# EAGLE design AJH_as3310_DUAL_ASR_02_4hp (EAGLE 9.5.2)
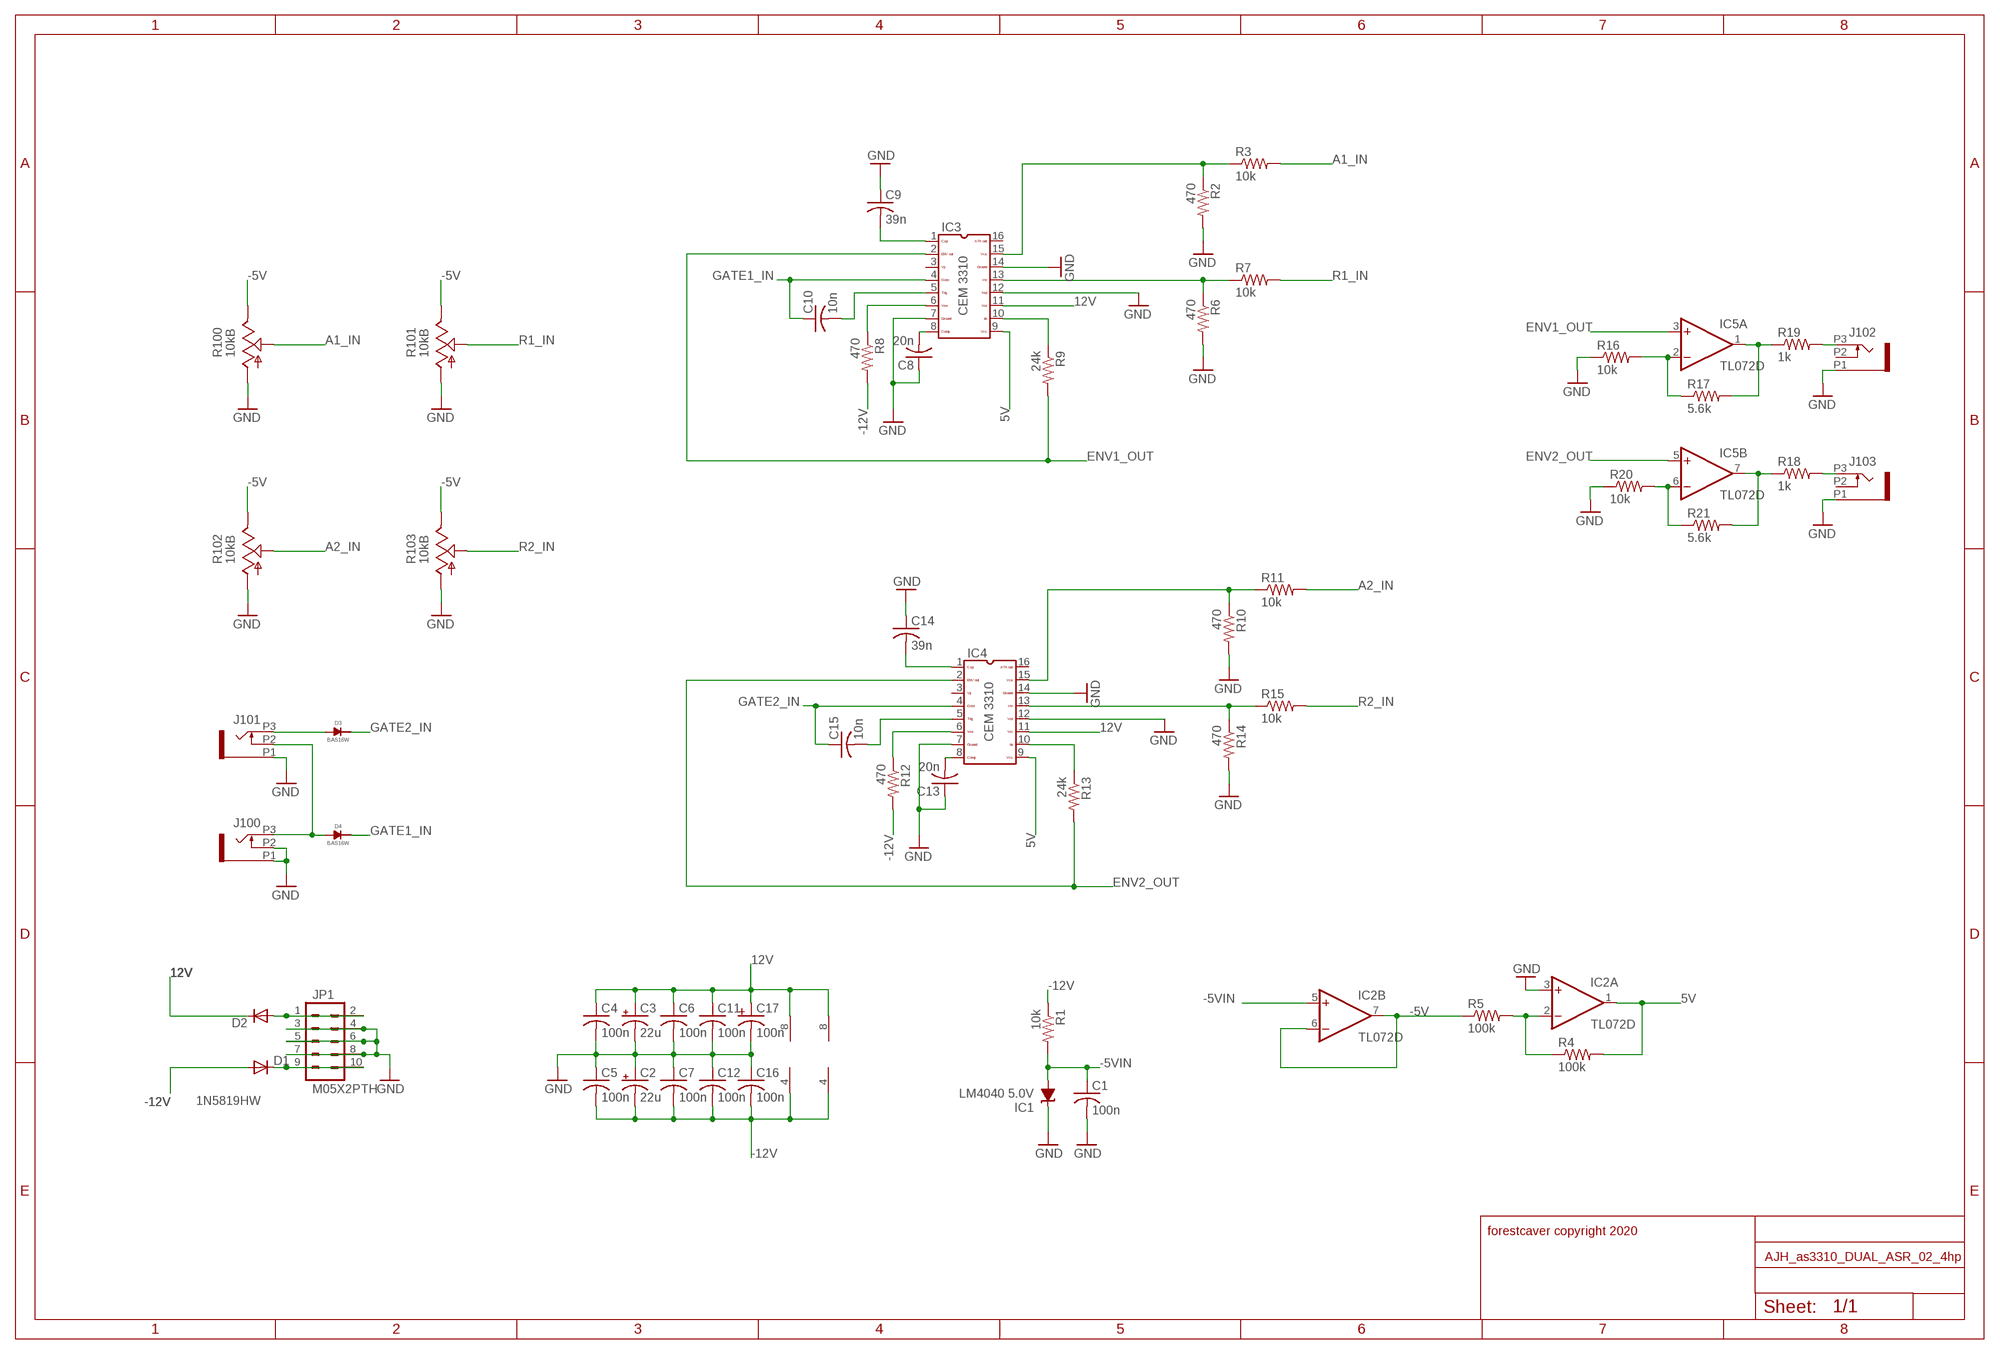
[diagram p0: schematic, sheet 1]

## Parts
C1  100n  C-USC0603  [C0603]
C2  22u  CPOL-USB  [PANASONIC_B]
C3  22u  CPOL-USB  [PANASONIC_B]
C4  100n  C-USC0603  [C0603]
C5  100n  C-USC0603  [C0603]
C6  100n  C-USC0603  [C0603]
C7  100n  C-USC0603  [C0603]
C8  20n  C-USC0603  [C0603]
C9  39n  C-USC0603  [C0603]
C10  10n  C-USC0603  [C0603]
C11  100n  C-USC0603  [C0603]
C12  100n  C-USC0603  [C0603]
C13  20n  C-USC0603  [C0603]
C14  39n  C-USC0603  [C0603]
C15  10n  C-USC0603  [C0603]
C16  100n  C-USC0603  [C0603]
C17  100n  C-USC0603  [C0603]
D1  1N5819HW  DIODE-SOD123  [SOD123]
D2  1N5819HW  DIODE-SOD123  [SOD123]
D3  BAS16W  [SOT-323]
D4  BAS16W  [SOT-323]
IC1  LM4040 5.0V  LM4041C12DBZ  [DBZ_R-PDSO-G3]
IC2  TL072D  [SO08]
IC3  CEM3310SOIC16  [SO16]
IC4  CEM3310SOIC16  [SO16]
IC5  TL072D  [SO08]
J100  PJ301_THONKICONN6  [WQP_PJ_301M6]
J101  PJ301_THONKICONN6  [WQP_PJ_301M6]
J102  PJ301_THONKICONN6  [WQP_PJ_301M6]
J103  PJ301_THONKICONN6  [WQP_PJ_301M6]
JP1  M05X2PTH  [AVR_ICSP]
R1  10k  R-US_R0603  [R0603]
R2  470  R-US_R0603  [R0603]
R3  10k  R-US_R0603  [R0603]
R4  100k  R-US_R0603  [R0603]
R5  100k  R-US_R0603  [R0603]
R6  470  R-US_R0603  [R0603]
R7  10k  R-US_R0603  [R0603]
R8  470  R-US_R0603  [R0603]
R9  24k  R-US_R0603  [R0603]
R10  470  R-US_R0603  [R0603]
R11  10k  R-US_R0603  [R0603]
R12  470  R-US_R0603  [R0603]
R13  24k  R-US_R0603  [R0603]
R14  470  R-US_R0603  [R0603]
R15  10k  R-US_R0603  [R0603]
R16  10k  R-US_R0603  [R0603]
R17  5.6k  R-US_R0603  [R0603]
R18  1k  R-US_R0603  [R0603]
R19  1k  R-US_R0603  [R0603]
R20  10k  R-US_R0603  [R0603]
R21  5.6k  R-US_R0603  [R0603]
R100  10kB  POT_USVERTICAL  [ALPS_POT_VERTICAL]
R101  10kB  POT_USVERTICAL  [ALPS_POT_VERTICAL]
R102  10kB  POT_USVERTICAL  [ALPS_POT_VERTICAL]
R103  10kB  POT_USVERTICAL  [ALPS_POT_VERTICAL]

## Nets
5V [power]: IC2.1(A:OUT) IC3.9 IC4.9 R4.2
12V [power]: C3.+ C4.1 C6.1 C11.1 C17.1 D2.C IC2.8(P:V+) IC3.11 IC4.11 IC5.8(P:V+)
-5V [power]: IC2.6(B:-IN) IC2.7(B:OUT) R5.1 R100.P$1(E) R101.P$1(E) R102.P$1(E) R103.P$1(E)
-5VIN [power]: C1.1 IC1.2(A) IC2.5(B:+IN) R1.2
-12V [power]: C2.- C5.2 C7.2 C12.2 C16.2 D1.A IC2.4(P:V-) IC5.4(P:V-) R1.1 R8.2 R12.2
A1_IN: R3.2 R100.P$2(S)
A2_IN: R11.2 R102.P$2(S)
ENV1_OUT: IC3.2 IC5.3(A:+IN) R9.2
ENV2_OUT: IC4.2 IC5.5(B:+IN) R13.2
GATE1_IN: C10.1 D4.CATHODE IC3.4
GATE2_IN: C15.1 D3.CATHODE IC4.4
GND [power]: C1.2 C2.+ C3.- C4.2 C5.1 C6.2 C7.1 C8.1 C9.1 C11.2 C12.1 C13.1 C14.1 C16.1 C17.2 IC1.1(C) IC2.3(A:+IN) IC3.7 IC3.12 IC3.14 IC4.7 IC4.12 IC4.14 J100.P1 J100.P2 J101.P1 J102.P1 J103.P1 JP1.3 JP1.4 JP1.5 JP1.6 JP1.7 JP1.8 R2.2 R6.2 R10.2 R14.2 R16.1 R20.1 R100.P$3(A) R101.P$3(A) R102.P$3(A) R103.P$3(A)
N$1: D3.ANODE J101.P3
N$2: C15.2 IC4.5
N$3: C9.2 IC3.1
N$4: C8.2 IC3.8
N$5: C10.2 IC3.5
N$6: D2.A JP1.1 JP1.2
N$7: IC3.13 R6.1 R7.1
N$8: IC3.6 R8.1
N$9: C13.2 IC4.8
N$10: IC3.10 R9.1
N$11: IC4.6 R12.1
N$12: IC3.15 R2.1 R3.1
N$13: IC2.2(A:-IN) R4.1 R5.2
N$14: C14.2 IC4.1
N$15: IC4.10 R13.1
N$16: IC4.13 R14.1 R15.1
N$17: IC4.15 R10.1 R11.1
N$18: IC5.6(B:-IN) R20.2 R21.1
N$19: IC5.7(B:OUT) R18.1 R21.2
N$20: D1.C JP1.9 JP1.10
N$21: IC5.2(A:-IN) R16.2 R17.1
N$23: IC5.1(A:OUT) R17.2 R19.1
N$24: J102.P3 R19.2
N$25: J103.P3 R18.2
N$26: D4.ANODE J100.P3 J101.P2
R1_IN: R7.2 R101.P$2(S)
R2_IN: R15.2 R103.P$2(S)
Unconnected: IC3.3 IC3.16 IC4.3 IC4.16 J102.P2 J103.P2

## Notes on the sheet
- +
- forestcaver copyright 2020

## Library data of the parts
C1 C4-C17 = rcl:C-US: CAPACITOR, American symbol
C2 C3 = rcl:CPOL-US: POLARIZED CAPACITOR, American symbol
D1 D2 = diode:DIODE-: DIODE
D3 D4 = FenixBase:BAS16W
IC1 = texas:LM4041: PRECISION MICROPOWER SHUNT VOLTAGE REFERENCE Source: http://focus.ti.com/lit/ds/slcs146e/slcs146e.pdf
IC2 IC5 = linear:TL072: OP AMP
IC3 IC4 = CEM:CEM3310: CEM 3310 VCEG
J100-J103 = og-pj301_variations:PJ301_THONKICONN
JP1 = og-header:M05X2: Header 5x2 Standard 10-pin dual row 0.1" header. Commonly used with AVR-ISP. Use with Spark Fun Electronics SKU: PRT-00778
R1-R21 = resistor:R-US_: RESISTOR, American symbol
R100-R103 = og-pots:POT_US

## Net classes
0 default: width 0.152 mm
1 power: width 0.406 mm
2 nearfilter: width 0.152 mm

## Board
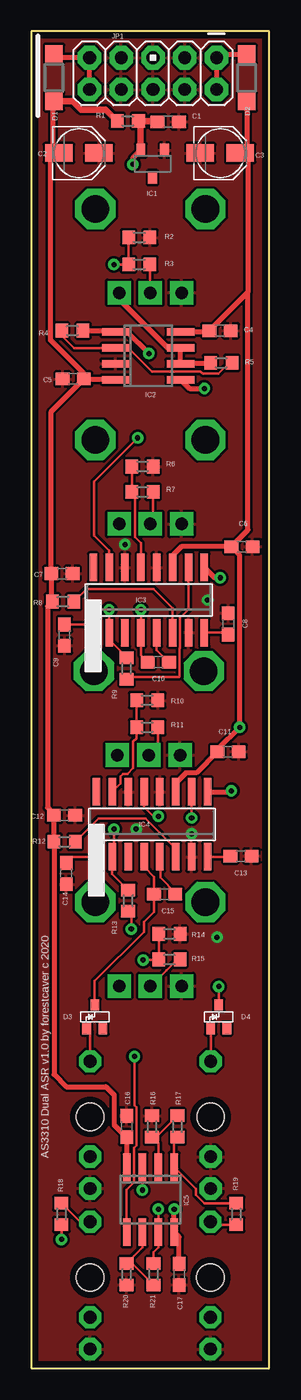
[diagram p1: board, top side]
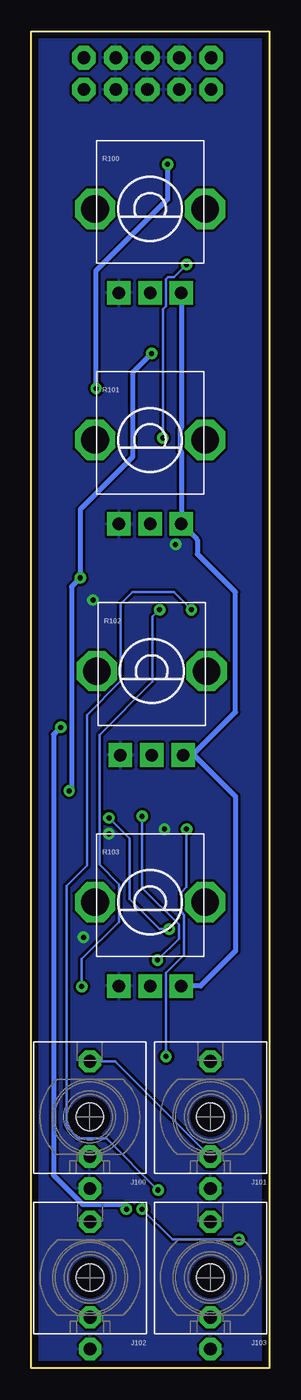
[diagram p2: board, bottom side, seen from below]

Size 19.03 x 106.76 mm. Coordinates in mm from the lower left corner, seen from the top.
Outline: 0,0 19.03,0 19.03,106.76 0,106.76 0,0
Copper layers (1*16): Top 0.035mm / dielectric 1.5mm / Bottom 0.035mm
Design rules "Mutable_PCBCart-Standard": minimum track width 8mil, minimum drill 0.4mm, track to track 8mil, track to pad 8mil, pad to pad 8mil, via to via 8mil, smd to smd 8mil, copper to edge 20mil, drill to drill 8mil, minimum pad ring 8mil, minimum via ring 10mil, stop-mask expansion 3mil, vias tented up to drill 25mil, thermal gap 8mil

### Footprints (pad centres in the part's own frame; a part is rotated, then mirrored left to right if it is on the bottom)
C0603 = smd 1.1 x 1: 1 -0.85,0; 2 0.85,0
PANASONIC_B = smd 2.2 x 1.4: + 1.6,0; - -1.6,0
SOD123 = smd 1.4 x 1.4: A 1.9,0; C -1.9,0
SOT-323 = smd 0.7 x 0.9: ANODE -0.65,-0.95; CATHODE 0,0.95; NC 0.65,-0.95
DBZ_R-PDSO-G3 = smd 0.7 x 1: 1 -0.95,-1.1; 2 0.95,-1.1; 3 0,1.1
SO08 = smd 0.6 x 2.2: 1 -1.905,-2.6; 2 -0.635,-2.6; 3 0.635,-2.6; 4 1.905,-2.6; 5 1.905,2.6; 6 0.635,2.6; 7 -0.635,2.6; 8 -1.905,2.6
SO16 = smd 0.6 x 2.2: 1 -4.445,-2.6; 2 -3.175,-2.6; 3 -1.905,-2.6; 4 -0.635,-2.6; 5 0.635,-2.6; 6 1.905,-2.6; 7 3.175,-2.6; 8 4.445,-2.6; 9 4.445,2.6; 10 3.175,2.6; 11 1.905,2.6; 12 0.635,2.6; 13 -0.635,2.6; 14 -1.905,2.6; 15 -3.175,2.6; 16 -4.445,2.6
WQP_PJ_301M6 = drill 1.016 pad 1.778 octagon: P1 0,-5.715; P2 0,-3.175; P3 0,4.445 | hole 2.2: 0,0
AVR_ICSP = drill 1.016 pad 1.88 octagon: 1 -1.27,5.08; 2 1.27,5.08; 3 -1.27,2.54; 4 1.27,2.54; 5 -1.27,0; 6 1.27,0; 7 -1.27,-2.54; 8 1.27,-2.54; 9 -1.27,-5.08; 10 1.27,-5.08
R0603 = smd 1 x 1.1: 1 -0.85,0; 2 0.85,0
ALPS_POT_VERTICAL = drill 1 pad 1.88 square: P$1 -2.5,6.7; P$2 0,6.7; P$3 2.5,6.7 | drill 2.2 pad 3.175 octagon: P$4 -4.4,0; P$5 4.4,0

### Placement (x,y rotation side)
C1  10.95,99.53 0 top
C2  3.81,97.03 0 top
C3  15.11,97.03 0 top
C4  15.09,82.86 0 top
C5  3.35,78.99 0 top
C6  16.84,65.6 0 top
C7  2.46,63.46 180 top
C8  15.75,59.44 270 top
C9  2.67,58.55 90 top
C10  10.16,56.39 0 top
C11  15.73,49.23 0 top
C12  2.65,44.15 180 top
C13  16.76,40.89 180 top
C14  2.79,39.5 90 top
C15  10.67,37.85 0 top
C16  7.62,19.3 270 top
C17  11.81,7.49 270 top
D1  1.83,103.06 270 top
D2  17.23,103.04 90 top
D3  5.08,28.07 0 top
D4  14.99,28.07 0 top
IC1  9.7,96.17 180 top
IC2  9.35,80.84 270 top
IC3  9.4,61.34 0 top
IC4  9.65,43.43 0 top
IC5  9.53,13.46 180 top
J100  14.35,20.07 0 bottom
J101  4.7,20.07 0 bottom
J102  14.33,7.24 0 bottom
J103  4.7,7.24 0 bottom
JP1  9.74,103.38 270 top
R1  7.73,99.59 0 top
R2  8.64,90.3 0 top
R3  8.64,88.14 0 top
R4  3.28,82.86 0 top
R5  15.19,80.28 0 top
R6  8.89,72.01 0 top
R7  8.89,69.98 0 top
R8  2.54,61.21 180 top
R9  7.62,55.88 90 top
R10  9.27,53.34 0 top
R11  9.27,51.18 0 top
R12  2.67,42.04 180 top
R13  7.75,37.34 90 top
R14  11.05,34.67 0 top
R15  11.05,32.64 0 top
R16  9.65,19.3 270 top
R17  11.68,19.3 270 top
R18  2.41,12.32 90 top
R19  16.38,12.32 270 top
R20  7.62,7.49 90 top
R21  9.78,7.49 90 top
R100  9.53,92.58 180 bottom
R101  9.53,74.13 180 bottom
R102  9.4,55.67 180 bottom
R103  9.53,37.21 180 bottom

### Tracks (layer width: path | path; a pad name or v marks a point on that pad's centre or on a via)
5V  (via drill 0.4)
  Top 0.406: R4.2 6.64,82.86 IC2.1 7.68,82.75 v9.4,81.03 | IC4.9 15.94,46.03 v16,46.1 | v15.11,63.12 14.66,63.12 IC3.9
  Bottom 0.406: v16,46.1 15.81,46.29 15.81,62.42 v15.11,63.12 15.11,68.58 10.92,72.77 10.92,79.5 v9.4,81.03
12V  (via drill 0.4)
  Top 0.406: IC2.8 14.14,82.75 C4.1 17.33,85.94 | IC3.11 11.36,64 11.36,64.95 12,65.6 C6.1 | IC4.11 11.56,46.74 12.36,47.54 13.19,47.54 C11.1 14.88,49.39 v16.67,51.18 16.67,64.92 C6.1 | C6.1 17.33,66.93 17.33,85.94 | D2.C 17.23,97.54 C3.+ 17.33,96.41 17.33,85.94 | C17.1 11.81,10.48 IC5.8 v11.43,12.7
  Bottom 0.406: v11.43,12.7 11.79,13.06 14.89,13.06 17.24,15.41 17.24,50.61 v16.67,51.18
-5V
  Top 0.406: R5.1 14.27,80.21 IC2.6 IC2.7 10.92,81.48 7.03,85.38 R100.P$1
  Bottom 0.406: R103.P$1 5.5,30.51 2.71,33.3 2.71,45.66 6.01,48.97 R102.P$1 6.14,48.97 2.71,52.4 2.71,61.97 5.75,65.01 5.75,66.16 R101.P$1 7.03,73.18 7.14,73.29 7.14,74.96 7.03,75.07 R100.P$1
-5VIN  (via drill 0.4)
  Top 0.406: IC2.5 12.65,78.23 v13.84,78.23 | IC1.2 8.13,96.65 v8.13,96.14
  Top 0.508: C1.1 10.04,99.59 R1.2 8.75,99.42 IC1.2
  Bottom 0.406: v13.84,78.23 13.88,78.27 13.88,87.59 8.13,93.34 v8.13,96.14
-12V
  Top 0.406: C5.2 6.69,78.99 IC2.4 | C5.2 1.61,76.4 C7.2 1.61,61.29 R8.2 1.31,60.83 1.31,44.77 1.8,44.28 C12.2 1.8,42.05 R12.2 1.82,23.46 2.79,22.48 5.97,22.48 6.64,21.81 6.64,19.44 C16.2 IC5.4 | C5.2 4.2,79.46 1.52,82.14 1.52,96.34 C2.- 1.7,97.54 1.7,101.03 D1.A
  Top 0.508: D1.A 3.32,101.16 3.97,100.51 5.96,100.51 R1.1
A1_IN
  Top 0.203: R100.P$2 9.49,85.92 R3.2
A2_IN
  Top 0.203: R11.2 10.12,49.69 R102.P$2
ENV1_OUT  (via drill 0.4)
  Top 0.203: R9.2 7.62,56.78 6.22,58.18 IC3.2 v6.22,60.58 | v8.89,14.22 IC5.3
  Bottom 0.203: v6.22,60.58 7.62,61.98 10.92,61.98 11.88,61.01 11.88,54.88 14.58,52.18 14.58,40.15 16.22,38.51 16.22,19.26 15.31,18.36 13.02,18.36 v8.89,14.22
ENV2_OUT  (via drill 0.4)
  Top 0.203: R13.2 6.48,39.46 IC4.2 6.6,40.96 v6.6,43.05 | IC5.5 7.62,14.23 8.22,14.84 8.22,17.58 8.43,17.78 8.43,20.83 8.26,21 v8.26,24.89
  Bottom 0.203: v6.6,43.05 6.6,38.44 7.04,38 7.04,36.42 6.83,36.21 6.83,33.01 8.27,31.58 8.27,26.56 8.26,26.54 v8.26,24.89
GATE1_IN  (via drill 0.4)
  Top 0.203: C10.1 8.76,56.94 IC3.4 v8.76,60.58 | D4.CATHODE v14.99,30.48
  Bottom 0.203: v8.76,60.58 9.32,60.02 9.32,54.84 13.59,50.57 13.59,40.21 12.01,38.64 12.01,35.66 14.99,32.68 v14.99,30.48
GATE2_IN
  Top 0.203: IC4.4 9.05,40.8 9.05,40.01 9.82,39.24 C15.1 9.82,36.44 9.01,35.64 9.01,34.85 5.08,30.92 D3.CATHODE
GND  (via drill 0.4)
  other vias: 7.49,65.79 8.38,43.05 14.86,34.42 12.83,42.67 14.1,61.34
  pour Top: -0.89,107.7 19.43,107.7 20.07,107.06 20.32,106.81 20.32,-0.25 19.3,-1.27 -0.25,-1.27 -0.89,-0.64
  pour Bottom: -1.4,108.33 20.07,108.33 20.07,-0.64 -1.14,-0.64 -1.4,-0.38
N$1
  Top 0.203: J101.P3 4.7,26.85 D3.ANODE
N$2
  Top 0.203: IC4.5 10.32,40.8 10.32,39.17 11.52,37.97 C15.2
N$3
  Top 0.203: C9.2 4.3,59.4 IC3.1
N$4
  Top 0.203: IC3.8 15.59,58.74 C8.2
N$5
  Top 0.203: C10.2 10.03,57.37 IC3.5
N$6
  Top 0.406: JP1.2 JP1.1 15.11,104.94 D2.A
N$7
  Top 0.203: R6.1 R7.1 8.28,69.74 8.28,66.36 8.76,65.88 IC3.13
N$8
  Top 0.203: IC3.6 11.3,60.7 9.77,62.23 4.41,62.23 R8.1
N$9
  Top 0.203: C13.2 15.85,40.83 IC4.8
N$10
  Top 0.203: IC3.10 12.57,60.57 11.91,59.91 11.91,57.52 11.87,57.47 11.87,55.25 11.81,55.2 7.79,55.2 R9.1
N$11
  Top 0.203: IC4.6 11.56,41.47 9.14,43.89 5.37,43.89 R12.1
N$12  (via drill 0.4)
  Top 0.203: R2.1 R3.1 v6.6,88.14 | IC3.15 6.22,65.28 5.02,66.49 5.02,70.8 v8.51,74.3
  Bottom 0.203: v6.6,88.14 7.61,87.13 8.09,87.13 8.27,86.95 8.27,84.83 8.51,84.59 v8.51,74.3
N$13
  Top 0.203: R4.1 2.43,82.47 3.43,81.48 IC2.2 7.76,81.48 9.64,79.6 13.54,79.6 13.72,79.42 14.97,79.42 15.82,80.28 R5.2
N$14
  Top 0.203: C14.2 3.28,40.83 IC4.1
N$15  (via drill 0.4)
  Top 0.203: R13.1 8,36.24 v8,35.06 | v12.83,43.94 IC4.10
  Bottom 0.203: v8,35.06 8.76,35.06 11.18,37.48 11.18,42.29 v12.83,43.94
N$16  (via drill 0.4)
  Top 0.203: R14.1 R15.1 10.15,32.59 v8.94,32.59 | v10.16,44.07 9.78,44.07 9.02,44.83 IC4.13
  Bottom 0.203: v8.94,32.59 7.24,34.29 7.24,35.43 10.16,38.35 v10.16,44.07
N$17
  Top 0.203: R10.1 R11.1 8.42,50.3 8.15,50.03 8.15,47.91 7.68,47.44 7.32,47.44 7.14,47.26 7.14,46.7 IC4.15
N$18
  Top 0.203: IC5.6 8.89,9.65 7.62,8.38 R20.2 8.08,8.34 R21.1
N$19  (via drill 0.4)
  Top 0.203: R21.2 9.78,9.27 10.16,9.65 IC5.7 v10.16,12.7 | R18.1 v2.41,10.29
  Bottom 0.203: v2.41,10.29 7.75,10.29 v10.16,12.7
N$20
  Top 0.406: D1.C 2.14,104.65 JP1.9 JP1.10
N$21
  Top 0.203: R16.2 9.8,18.31 | 9.8,18.31 10.16,17.95 IC5.2 | R17.1 9.84,18.31 9.8,18.31
N$23
  Top 0.203: R17.2 11.43,18.2 IC5.1 13.16,14.34 13.16,13.86 13.86,13.16 14.85,13.16 14.86,13.17 R19.1
N$24
  Top 0.203: R19.2 14.54,11.47 J102.P3
N$25
  Top 0.203: R18.2 3.9,11.68 J103.P3
N$26
  Top 0.203: J100.P3 14.35,27.1 D4.ANODE
  Bottom 0.203: J101.P2 12.32,24.51 J100.P3
R1_IN
  Top 0.203: R7.2 9.74,67.64 R101.P$2
R2_IN
  Top 0.203: R103.P$2 10.8,31.78 10.82,31.78 11.68,32.64 R15.2

### Text on the board
tPlace: AS3310 Dual ASR v1.0 by forestcaver c 2020